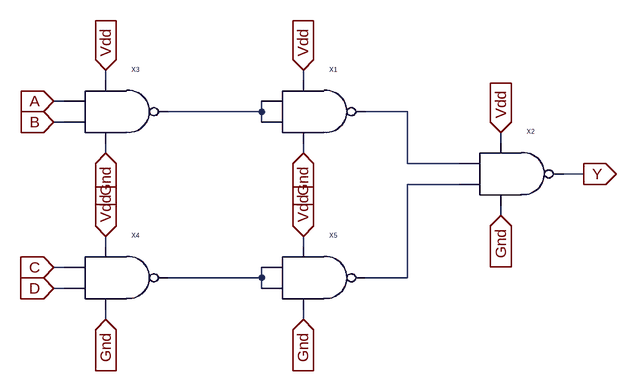
[diagram p0: schematic 4nand.asc]
4nand.asc, the LTspice schematic file:
Version 4
SHEET 1 880 680
WIRE -128 16 -128 0
WIRE 176 16 176 0
WIRE -192 48 -208 48
WIRE 112 64 112 48
WIRE 112 64 -32 64
WIRE 336 64 272 64
WIRE -192 80 -208 80
WIRE 112 80 112 64
WIRE 480 112 480 96
WIRE -128 128 -128 112
WIRE 176 128 176 112
WIRE 336 144 336 64
WIRE 416 144 336 144
WIRE 608 160 576 160
WIRE 416 176 336 176
WIRE 480 224 480 208
WIRE -128 272 -128 256
WIRE 176 272 176 256
WIRE -192 304 -208 304
WIRE 112 320 112 304
WIRE 112 320 -32 320
WIRE 336 320 336 176
WIRE 336 320 272 320
WIRE -192 336 -208 336
WIRE 112 336 112 320
WIRE -128 384 -128 368
WIRE 176 384 176 368
FLAG -128 0 Vdd
IOPIN -128 0 In
FLAG 176 0 Vdd
IOPIN 176 0 In
FLAG -128 256 Vdd
IOPIN -128 256 In
FLAG 176 256 Vdd
IOPIN 176 256 In
FLAG 480 96 Vdd
IOPIN 480 96 In
FLAG -208 48 A
IOPIN -208 48 In
FLAG -208 80 B
IOPIN -208 80 In
FLAG -208 304 C
IOPIN -208 304 In
FLAG -208 336 D
IOPIN -208 336 In
FLAG 608 160 Y
IOPIN 608 160 Out
FLAG 176 128 Gnd
IOPIN 176 128 In
FLAG -128 128 Gnd
IOPIN -128 128 In
FLAG -128 384 Gnd
IOPIN -128 384 In
FLAG 176 384 Gnd
IOPIN 176 384 In
FLAG 480 224 Gnd
IOPIN 480 224 In
SYMBOL nand 176 64 R0
SYMATTR InstName X1
SYMBOL nand 480 160 R0
SYMATTR InstName X2
SYMBOL nand -128 64 R0
SYMATTR InstName X3
SYMBOL nand -128 320 R0
SYMATTR InstName X4
SYMBOL nand 176 320 R0
SYMATTR InstName X5

The netlist it stands for:
* 4nand.asc
XX1 N001 N001 Vdd Gnd N002 nand  ; pins A B vdd gnd Y
XX2 N002 N003 Vdd Gnd Y nand  ; pins A B vdd gnd Y
XX3 A B Vdd Gnd N001 nand  ; pins A B vdd gnd Y
XX4 C D Vdd Gnd N004 nand  ; pins A B vdd gnd Y
XX5 N004 N004 Vdd Gnd N003 nand  ; pins A B vdd gnd Y
.backanno
.end